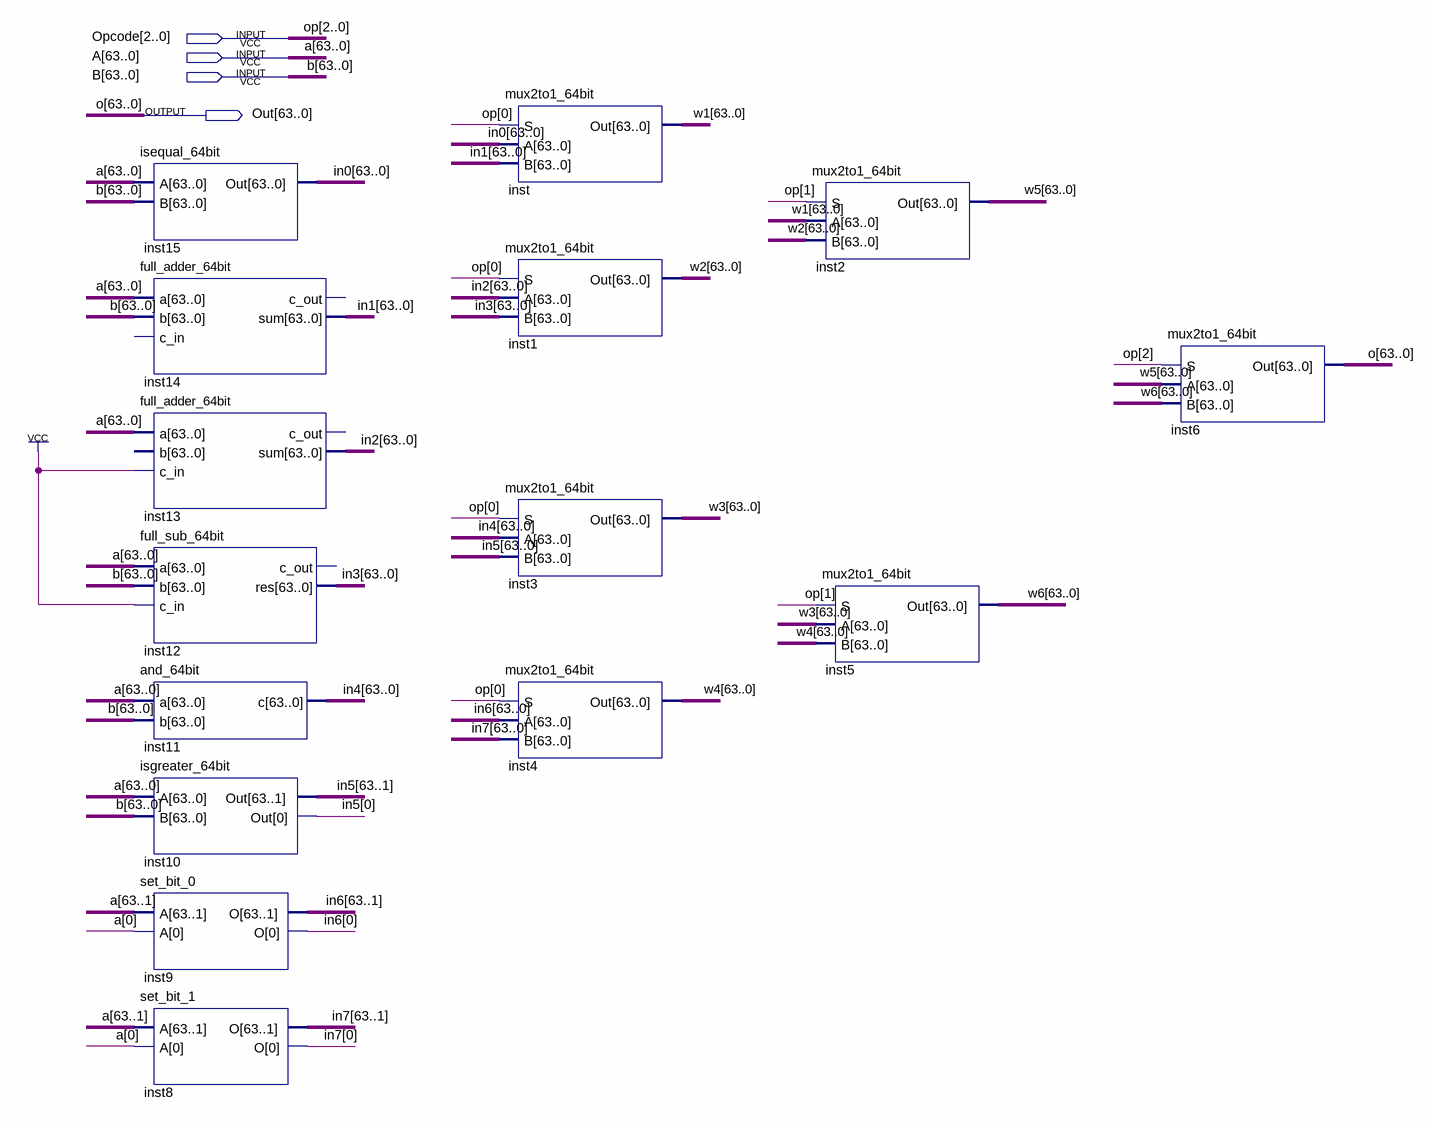
[diagram p0: schematic sheet]
// Quartus schematic ALU_64bit.bdf as structural Verilog: 15 symbols, 4 pins
module ALU_64bit (
  input  [2:0] Opcode,
  input  [63:0] A,
  input  [63:0] B,
  output [63:0] Out
);

  wire [63:0] in0, in1, in2, in3, in4, in5, in6, in7, w1, w2, w3, w4, w5, w6;

  isequal_64bit inst15 (.A(A), .B(B), .Out(in0));
  full_adder_64bit inst14 (.a(A), .b(B), .sum(in1));  // open: c_in, c_out
  full_adder_64bit inst13 (.a(A), .c_in(1'b1), .sum(in2));  // open: b, c_out
  full_sub_64bit inst12 (.a(A), .b(B), .c_in(1'b1), .res(in3));  // open: c_out
  and_64bit inst11 (.a(A), .b(B), .c(in4));
  isgreater_64bit inst10 (.A(A), .B(B), .Out(in5));
  set_bit_0 inst9 (.A(A), .O(in6));
  set_bit_1 inst8 (.A(A), .O(in7));
  mux2to1_64bit inst (.S(Opcode[0]), .A(in0), .B(in1), .Out(w1));
  mux2to1_64bit inst1 (.S(Opcode[0]), .A(in2), .B(in3), .Out(w2));
  mux2to1_64bit inst3 (.S(Opcode[0]), .A(in4), .B(in5), .Out(w3));
  mux2to1_64bit inst4 (.S(Opcode[0]), .A(in6), .B(in7), .Out(w4));
  mux2to1_64bit inst2 (.S(Opcode[1]), .A(w1), .B(w2), .Out(w5));
  mux2to1_64bit inst5 (.S(Opcode[1]), .A(w3), .B(w4), .Out(w6));
  mux2to1_64bit inst6 (.S(Opcode[2]), .A(w5), .B(w6), .Out(Out));

  // Other names for the same wires on the sheet: o[63:0] = Out; op[2:0] = Opcode
endmodule
